# Altium schematic sheet _PCB_2L - Revision History.SchDoc
size A4; DocumentNumber: 1; SheetNumber: 1; SheetTotal: 2
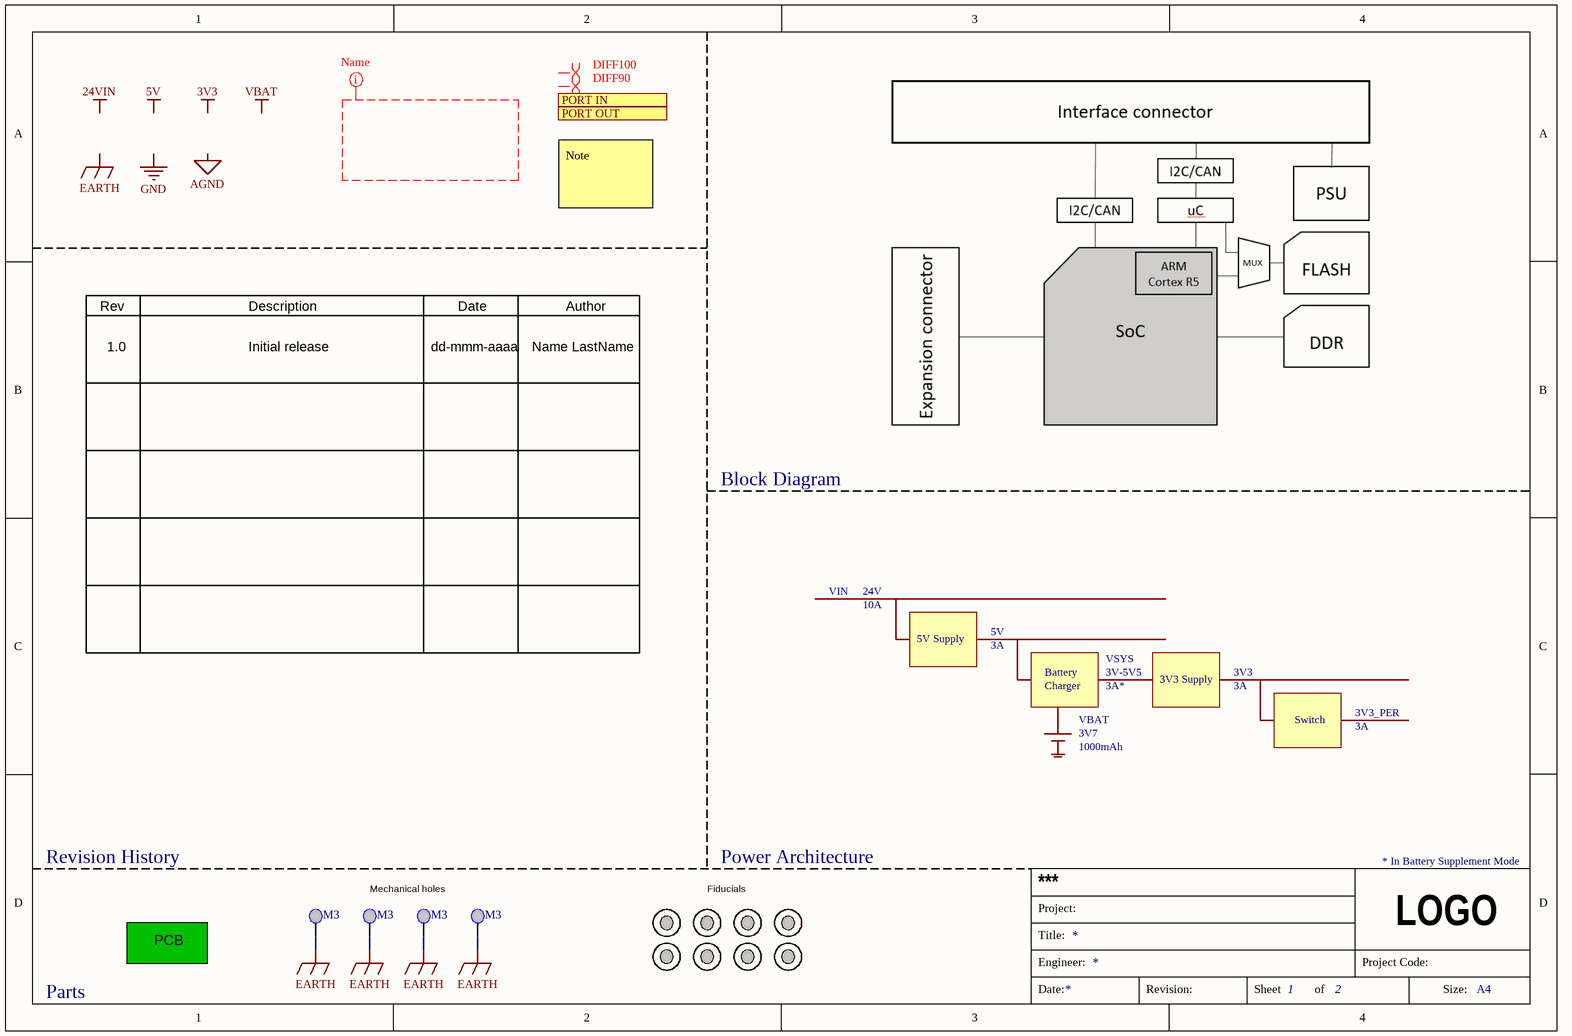
[diagram p0: _PCB_2L - Revision History.SchDoc]

## Parts
_PCB1  PCB spec  (value not drawn)  (mechanical)
FD1  Fiducial 1.3  [Fiducial 1.3mm]  (value not drawn)  (no BOM)
FD2  Fiducial 1.3  [Fiducial 1.3mm]  (value not drawn)  (no BOM)
FD3  Fiducial 1.3  [Fiducial 1.3mm]  (value not drawn)  (no BOM)
FD4  Fiducial 1.3  [Fiducial 1.3mm]  (value not drawn)  (no BOM)
FD5  Fiducial 1.3  [Fiducial 1.3mm]  (value not drawn)  (no BOM)
FD6  Fiducial 1.3  [Fiducial 1.3mm]  (value not drawn)  (no BOM)
FD7  Fiducial 1.3  [Fiducial 1.3mm]  (value not drawn)  (no BOM)
FD8  Fiducial 1.3  [Fiducial 1.3mm]  (value not drawn)  (no BOM)
MEC1  M3  [M3 hole]  (no BOM)
MEC2  M3  [M3 hole]  (no BOM)
MEC3  M3  [M3 hole]  (no BOM)
MEC4  M3  [M3 hole]  (no BOM)

## Ports
PORT IN (in), PORT OUT (out)

## Nets
EARTH: MEC1.0 MEC2.0 MEC3.0 MEC4.0

## Layout directives
net class NetClass: (no net found under the mark)
differential pair; net class DIFF100: (no net found under the mark)
differential pair; net class DIFF90: (no net found under the mark)

## Notes on the sheet
- Note
- Rev
- Description
- Date
- Author
- 1.0
- Initial release
- dd-mmm-aaaa
- Name LastName
- Block Diagram
- VIN
- 24V
- 10A
- 5V Supply
- 5V
- 3A
- Battery
- Charger
- 3V-5V5
- 3A*
- VSYS
- 3V3 Supply
- 3V3
- 3V3_PER
- VBAT
- 3V7
- 1000mAh
- Switch
- Revision History
- Mechanical holes
- Fiducials
- Power Architecture
- * In Battery Supplement Mode
- Parts
- Labels drawn without touching a wire or pin: 3V3, 5V, 24VIN, AGND, EARTH, GND, VBAT
- Project:
- ***
- Title:
- Engineer:
- Project Code:
- LOGO
- Date:
- Revision:
- Sheet
- of
- Size:
- A4

## Library data of the parts
_PCB1 = PCB
FD1-FD8 = Fiducial 1.3: Fiducial 1.3mm
MEC1-MEC4 = M3 hole